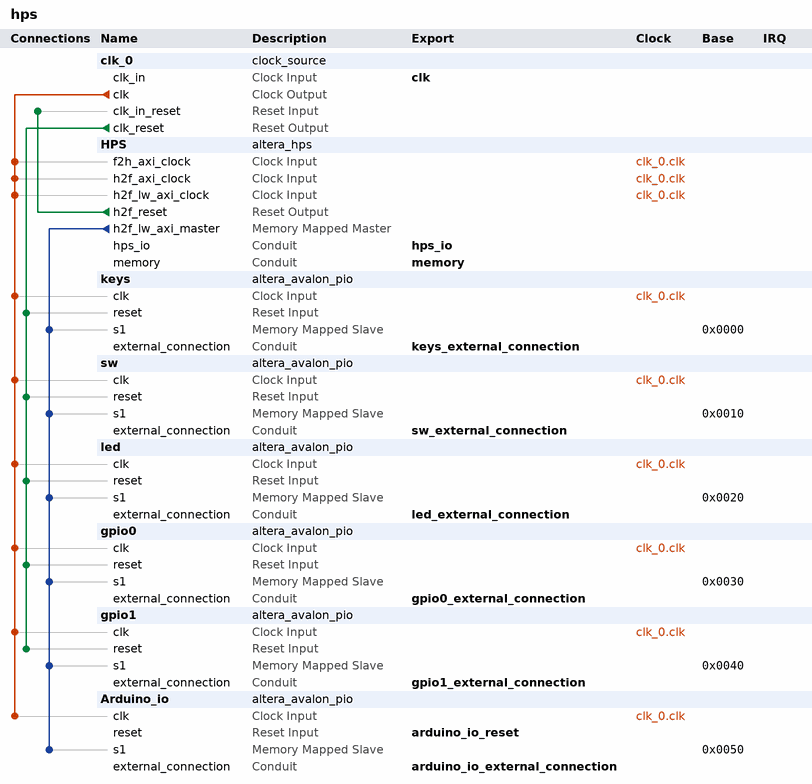
[diagram p0: system contents]
# Platform Designer (Qsys) system hps, Cyclone V 5CSEBA6U23I7
# Parameters at their usual value, and those the tool derives, are not listed.
package require -exact qsys 18.1
create_system hps
set_project_property DEVICE_FAMILY {Cyclone V}
set_project_property DEVICE 5CSEBA6U23I7

add_instance clk_0 clock_source 18.1
set_instance_parameter_value clk_0 clockFrequency 50000000

add_instance HPS altera_hps 18.1
set_instance_parameter_value HPS EMAC1_Mode N/A
set_instance_parameter_value HPS EMAC1_PinMuxing Unused
set_instance_parameter_value HPS F2SCLK_COLDRST_Enable false
set_instance_parameter_value HPS F2SCLK_DBGRST_Enable false
set_instance_parameter_value HPS F2SCLK_WARMRST_Enable false
set_instance_parameter_value HPS F2SINTERRUPT_Enable false
set_instance_parameter_value HPS F2S_Width 1
set_instance_parameter_value HPS FPGA_PERIPHERAL_OUTPUT_CLOCK_FREQ_EMAC0_GTX_CLK 125
set_instance_parameter_value HPS FPGA_PERIPHERAL_OUTPUT_CLOCK_FREQ_EMAC0_MD_CLK 2.5
set_instance_parameter_value HPS FPGA_PERIPHERAL_OUTPUT_CLOCK_FREQ_EMAC1_GTX_CLK 125
set_instance_parameter_value HPS FPGA_PERIPHERAL_OUTPUT_CLOCK_FREQ_EMAC1_MD_CLK 2.5
set_instance_parameter_value HPS HPS_PROTOCOL DDR3
set_instance_parameter_value HPS I2C0_Mode N/A
set_instance_parameter_value HPS I2C0_PinMuxing Unused
set_instance_parameter_value HPS I2C1_Mode N/A
set_instance_parameter_value HPS I2C1_PinMuxing Unused
set_instance_parameter_value HPS LWH2F_Enable true
set_instance_parameter_value HPS MEM_BANKADDR_WIDTH 3
set_instance_parameter_value HPS MEM_CLK_FREQ 300.0
set_instance_parameter_value HPS MEM_CLK_FREQ_MAX 400.0
set_instance_parameter_value HPS MEM_COL_ADDR_WIDTH 8
set_instance_parameter_value HPS MEM_DQ_WIDTH 8
set_instance_parameter_value HPS MEM_DRV_STR RZQ/6
set_instance_parameter_value HPS MEM_ROW_ADDR_WIDTH 12
set_instance_parameter_value HPS MEM_RTT_NOM {ODT Disabled}
set_instance_parameter_value HPS MEM_RTT_WR {Dynamic ODT off}
set_instance_parameter_value HPS MEM_TCL 7
set_instance_parameter_value HPS MEM_TFAW_NS 37.5
set_instance_parameter_value HPS MEM_TINIT_US 499
set_instance_parameter_value HPS MEM_TMRD_CK 3
set_instance_parameter_value HPS MEM_TRAS_NS 40.0
set_instance_parameter_value HPS MEM_TRCD_NS 15.0
set_instance_parameter_value HPS MEM_TREFI_US 7.0
set_instance_parameter_value HPS MEM_TRFC_NS 75.0
set_instance_parameter_value HPS MEM_TRP_NS 15.0
set_instance_parameter_value HPS MEM_TWTR 2
set_instance_parameter_value HPS MEM_VENDOR JEDEC
set_instance_parameter_value HPS MEM_WTCL 6
set_instance_parameter_value HPS QSPI_Mode N/A
set_instance_parameter_value HPS QSPI_PinMuxing Unused
set_instance_parameter_value HPS REF_CLK_FREQ 125.0
set_instance_parameter_value HPS S2FCLK_USER2CLK 5
set_instance_parameter_value HPS S2F_Width 1
set_instance_parameter_value HPS SDIO_Mode {4-bit Data}
set_instance_parameter_value HPS SDIO_PinMuxing {HPS I/O Set 0}
set_instance_parameter_value HPS SPIM1_Mode N/A
set_instance_parameter_value HPS SPIM1_PinMuxing Unused
set_instance_parameter_value HPS STM_Enable false
set_instance_parameter_value HPS TIMING_BOARD_AC_SKEW 0.02
set_instance_parameter_value HPS TIMING_BOARD_AC_TO_CK_SKEW 0.0
set_instance_parameter_value HPS TIMING_BOARD_DQ_TO_DQS_SKEW 0.0
set_instance_parameter_value HPS TIMING_BOARD_MAX_CK_DELAY 0.6
set_instance_parameter_value HPS TIMING_BOARD_MAX_DQS_DELAY 0.6
set_instance_parameter_value HPS TIMING_BOARD_SKEW_BETWEEN_DQS 0.02
set_instance_parameter_value HPS TIMING_BOARD_SKEW_CKDQS_DIMM_MAX 0.01
set_instance_parameter_value HPS TIMING_BOARD_SKEW_CKDQS_DIMM_MIN -0.01
set_instance_parameter_value HPS TIMING_BOARD_SKEW_WITHIN_DQS 0.02
set_instance_parameter_value HPS TIMING_TDH 125
set_instance_parameter_value HPS TIMING_TDQSCK 400
set_instance_parameter_value HPS TIMING_TDQSQ 120
set_instance_parameter_value HPS TIMING_TDS 50
set_instance_parameter_value HPS TIMING_TIH 250
set_instance_parameter_value HPS TIMING_TIS 175
set_instance_parameter_value HPS TIMING_TQSH 0.38
set_instance_parameter_value HPS UART0_Mode {No Flow Control}
set_instance_parameter_value HPS UART0_PinMuxing {HPS I/O Set 0}
set_instance_parameter_value HPS USB1_Mode N/A
set_instance_parameter_value HPS USB1_PinMuxing Unused
set_instance_parameter_value HPS desired_cfg_clk_mhz 100.0
set_instance_parameter_value HPS desired_qspi_clk_mhz 400.0

add_instance keys altera_avalon_pio 18.1
set_instance_parameter_value keys direction Input
set_instance_parameter_value keys width 2

add_instance sw altera_avalon_pio 18.1
set_instance_parameter_value sw direction Input
set_instance_parameter_value sw width 4

add_instance led altera_avalon_pio 18.1
set_instance_parameter_value led direction Output
set_instance_parameter_value led width 8

add_instance gpio0 altera_avalon_pio 18.1
set_instance_parameter_value gpio0 direction InOut
set_instance_parameter_value gpio0 width 32

add_instance gpio1 altera_avalon_pio 18.1
set_instance_parameter_value gpio1 direction InOut
set_instance_parameter_value gpio1 width 32

add_instance Arduino_io altera_avalon_pio 18.1
set_instance_parameter_value Arduino_io direction InOut
set_instance_parameter_value Arduino_io width 16

# connections
add_connection clk_0.clk Arduino_io.clk clock
add_connection clk_0.clk gpio0.clk clock
add_connection clk_0.clk gpio1.clk clock
add_connection clk_0.clk HPS.f2h_axi_clock clock
add_connection clk_0.clk HPS.h2f_axi_clock clock
add_connection clk_0.clk HPS.h2f_lw_axi_clock clock
add_connection clk_0.clk keys.clk clock
add_connection clk_0.clk led.clk clock
add_connection clk_0.clk sw.clk clock
add_connection clk_0.clk_reset gpio0.reset reset
add_connection clk_0.clk_reset gpio1.reset reset
add_connection clk_0.clk_reset keys.reset reset
add_connection clk_0.clk_reset led.reset reset
add_connection clk_0.clk_reset sw.reset reset
add_connection HPS.h2f_reset clk_0.clk_in_reset reset
add_connection HPS.h2f_lw_axi_master Arduino_io.s1 avalon
set_connection_parameter_value HPS.h2f_lw_axi_master/Arduino_io.s1 baseAddress 0x0050
add_connection HPS.h2f_lw_axi_master gpio0.s1 avalon
set_connection_parameter_value HPS.h2f_lw_axi_master/gpio0.s1 baseAddress 0x0030
add_connection HPS.h2f_lw_axi_master gpio1.s1 avalon
set_connection_parameter_value HPS.h2f_lw_axi_master/gpio1.s1 baseAddress 0x0040
add_connection HPS.h2f_lw_axi_master keys.s1 avalon
set_connection_parameter_value HPS.h2f_lw_axi_master/keys.s1 baseAddress 0x0000
add_connection HPS.h2f_lw_axi_master led.s1 avalon
set_connection_parameter_value HPS.h2f_lw_axi_master/led.s1 baseAddress 0x0020
add_connection HPS.h2f_lw_axi_master sw.s1 avalon
set_connection_parameter_value HPS.h2f_lw_axi_master/sw.s1 baseAddress 0x0010

# exported interfaces
add_interface arduino_io_external_connection conduit end
set_interface_property arduino_io_external_connection EXPORT_OF Arduino_io.external_connection
add_interface arduino_io_reset reset sink
set_interface_property arduino_io_reset EXPORT_OF Arduino_io.reset
add_interface clk clock sink
set_interface_property clk EXPORT_OF clk_0.clk_in
add_interface gpio0_external_connection conduit end
set_interface_property gpio0_external_connection EXPORT_OF gpio0.external_connection
add_interface gpio1_external_connection conduit end
set_interface_property gpio1_external_connection EXPORT_OF gpio1.external_connection
add_interface hps_io conduit end
set_interface_property hps_io EXPORT_OF HPS.hps_io
add_interface keys_external_connection conduit end
set_interface_property keys_external_connection EXPORT_OF keys.external_connection
add_interface led_external_connection conduit end
set_interface_property led_external_connection EXPORT_OF led.external_connection
add_interface memory conduit end
set_interface_property memory EXPORT_OF HPS.memory
add_interface sw_external_connection conduit end
set_interface_property sw_external_connection EXPORT_OF sw.external_connection

set_interconnect_requirement {$system} qsys_mm.clockCrossingAdapter HANDSHAKE
set_interconnect_requirement {$system} qsys_mm.enableEccProtection FALSE
set_interconnect_requirement {$system} qsys_mm.insertDefaultSlave FALSE
set_interconnect_requirement {$system} qsys_mm.maxAdditionalLatency 1

save_system hps.qsys
